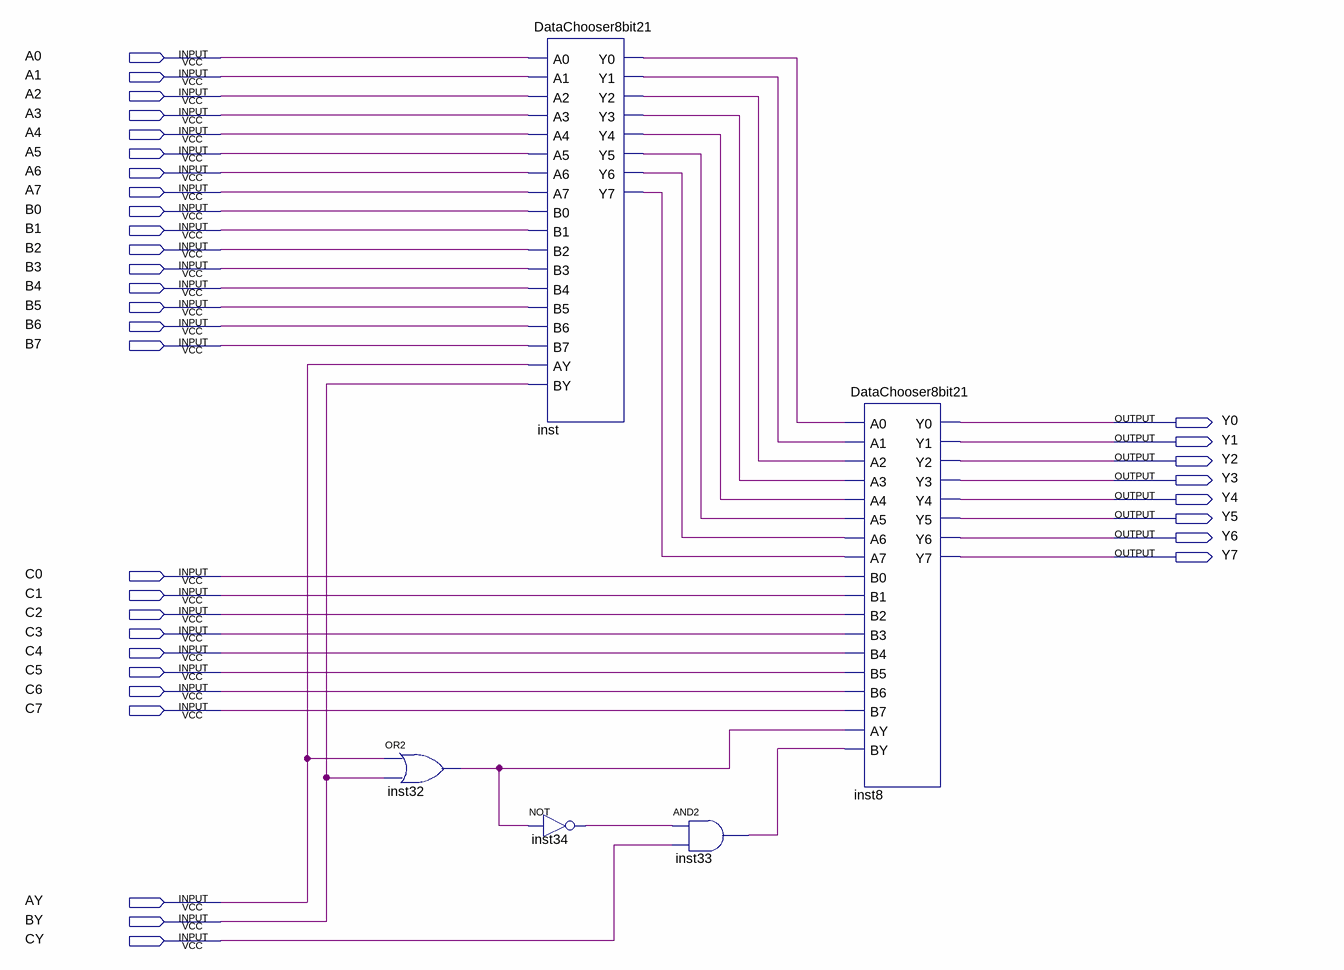
[diagram p0: schematic sheet]
// Quartus schematic DataChooser8bit31.bdf as structural Verilog: 5 symbols, 35 pins
module DataChooser8bit31 (
  input  A0,
  input  A1,
  input  A2,
  input  A3,
  input  A4,
  input  A5,
  input  A6,
  input  A7,
  input  B0,
  input  B1,
  input  B2,
  input  B3,
  input  B4,
  input  B5,
  input  B6,
  input  B7,
  input  C0,
  input  C1,
  input  C2,
  input  C3,
  input  C4,
  input  C5,
  input  C6,
  input  C7,
  input  AY,
  input  BY,
  input  CY,
  output Y0,
  output Y1,
  output Y2,
  output Y3,
  output Y4,
  output Y5,
  output Y6,
  output Y7
);

  wire inst32_out, inst33_out, inst34_out, inst_y0, inst_y1, inst_y2, inst_y3, inst_y4, inst_y5, inst_y6,
       inst_y7;

  or inst32 (inst32_out, AY, BY);
  DataChooser8bit21 inst (
    .A0(A0), .A1(A1), .A2(A2), .A3(A3), .A4(A4), .A5(A5), .A6(A6), .A7(A7), .B0(B0), .B1(B1), .B2(B2),
    .B3(B3), .B4(B4), .B5(B5), .B6(B6), .B7(B7), .AY(AY), .BY(BY), .Y0(inst_y0), .Y1(inst_y1), .Y2(inst_y2),
    .Y3(inst_y3), .Y4(inst_y4), .Y5(inst_y5), .Y6(inst_y6), .Y7(inst_y7));
  not inst34 (inst34_out, inst32_out);
  and inst33 (inst33_out, inst34_out, CY);
  DataChooser8bit21 inst8 (
    .A0(inst_y0), .A1(inst_y1), .A2(inst_y2), .A3(inst_y3), .A4(inst_y4), .A5(inst_y5), .A6(inst_y6),
    .A7(inst_y7), .B0(C0), .B1(C1), .B2(C2), .B3(C3), .B4(C4), .B5(C5), .B6(C6), .B7(C7), .AY(inst32_out),
    .BY(inst33_out), .Y0(Y0), .Y1(Y1), .Y2(Y2), .Y3(Y3), .Y4(Y4), .Y5(Y5), .Y6(Y6), .Y7(Y7));
endmodule
